# Altium schematic sheet Senkron_buck.SchDoc (part 1 of 3)
size A3; SheetNumber: 1; SheetTotal: 1
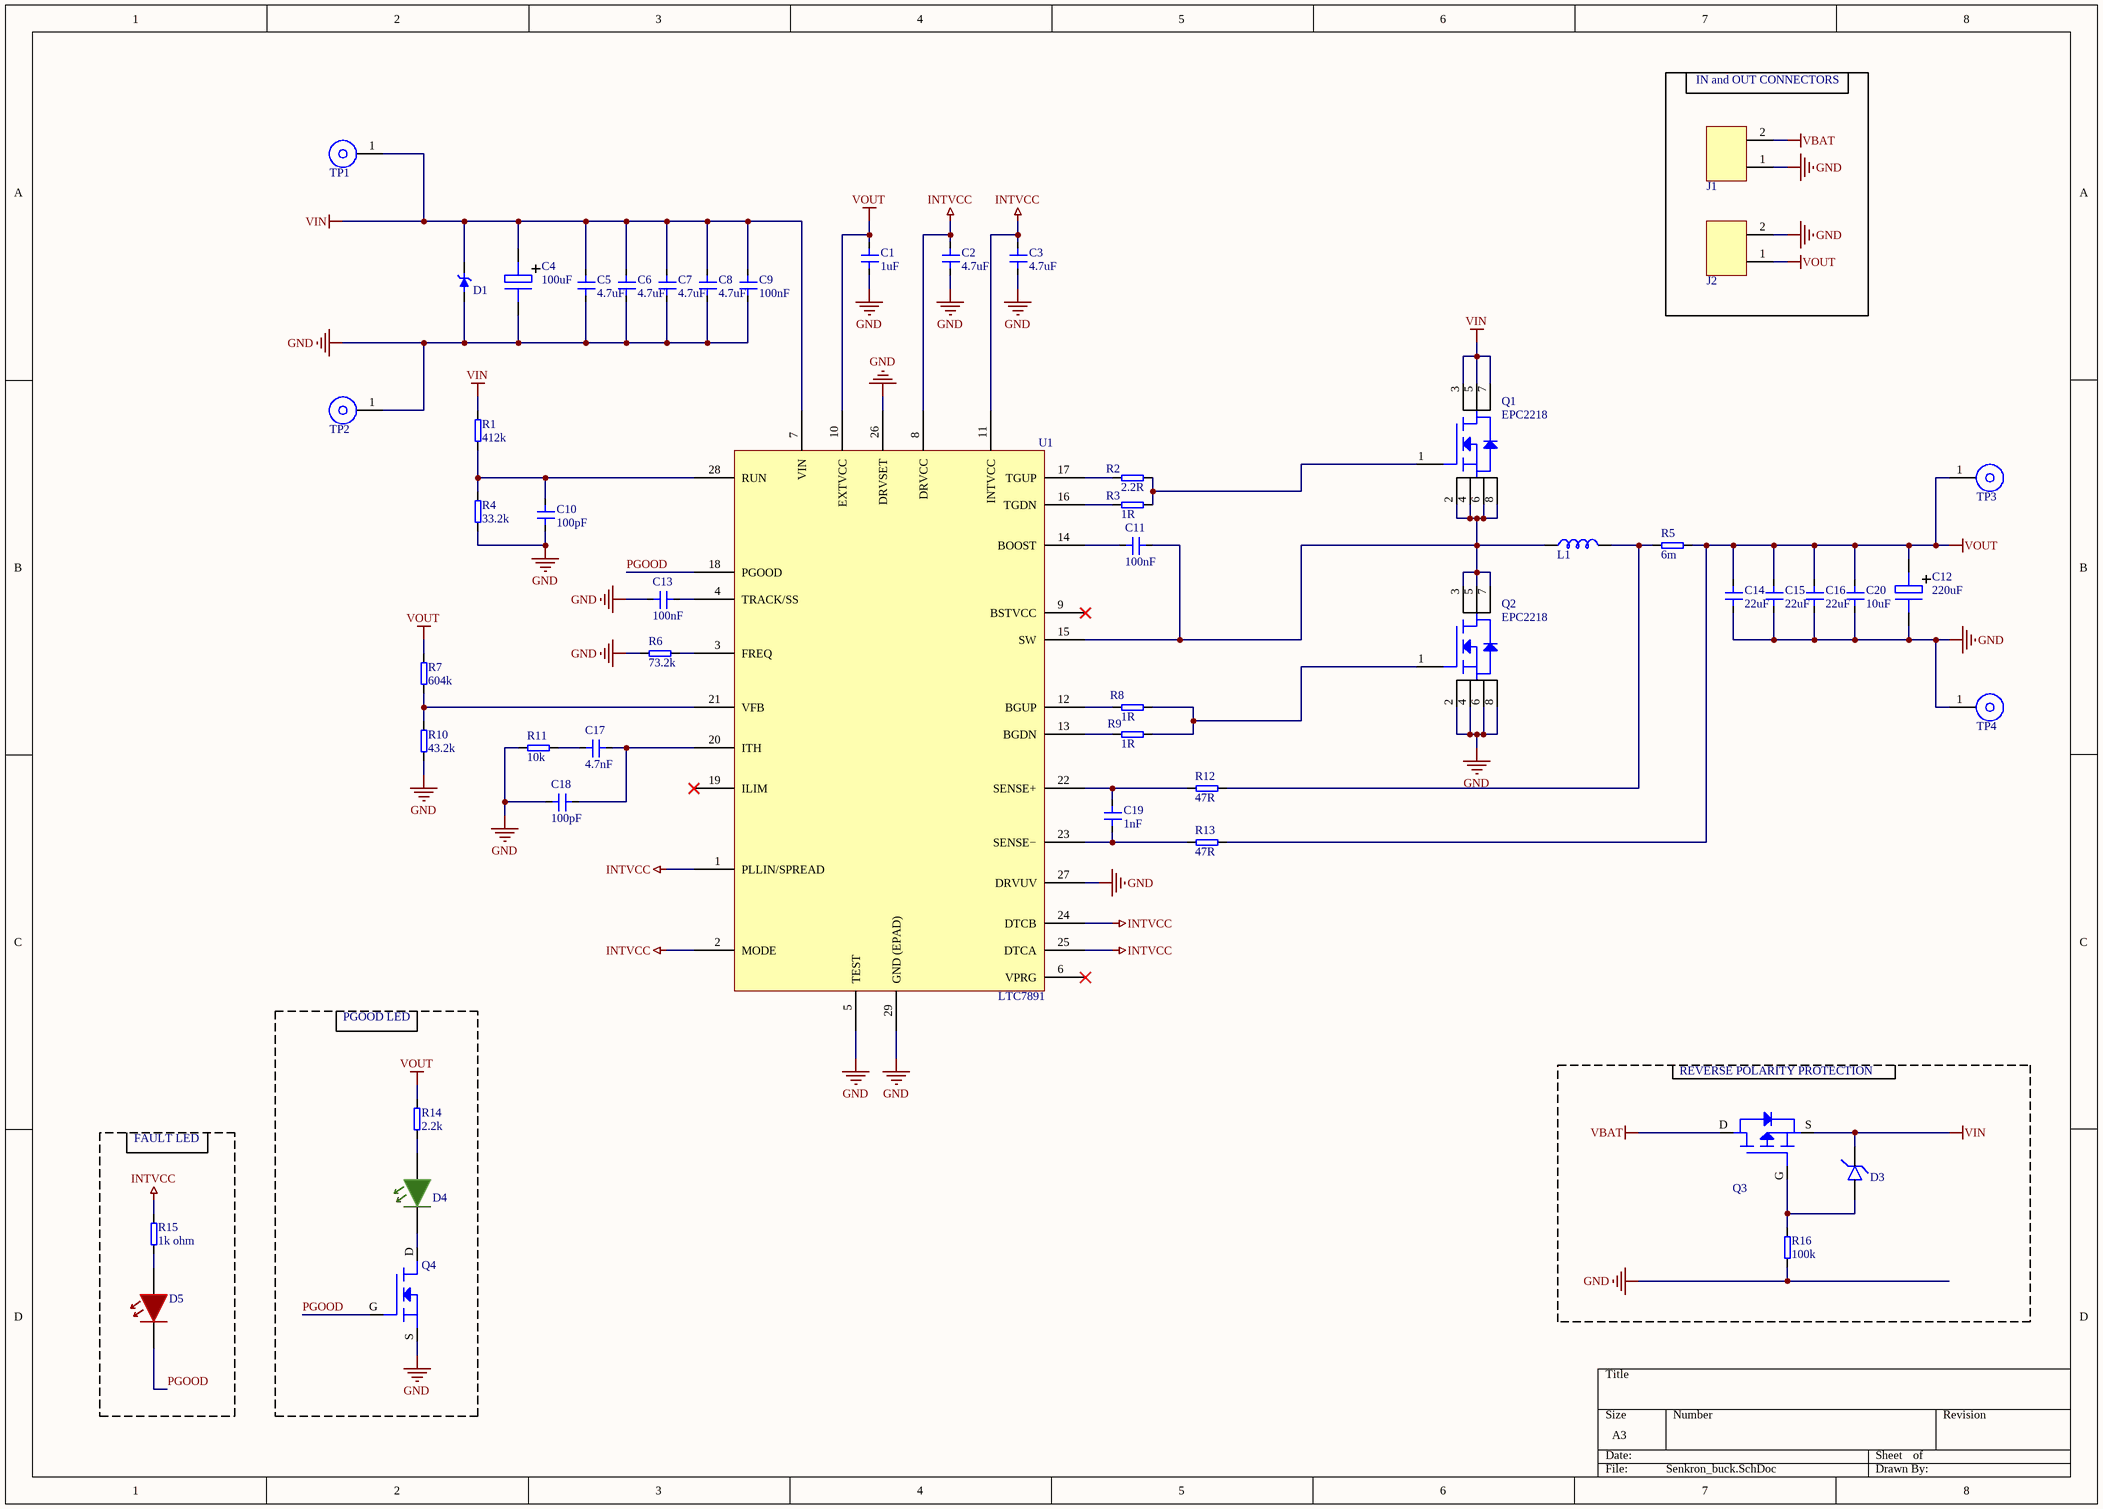
[diagram p0: Senkron_buck.SchDoc]

## Parts
C1  1uF  [0603 CAP SER]
C2  4.7uF  [0603 CAP SER]
C3  4.7uF  [0603 CAP SER]
C4  100uF  [CAP ELEC 12.5X10]
C5  4.7uF  [1210 CAP SER]
C6  4.7uF  [1210 CAP SER]
C7  4.7uF  [1210 CAP SER]
C8  4.7uF  [1210 CAP SER]
C9  100nF  [0603 CAP SER]
C10  100pF  [0603 CAP SER]
C11  100nF  [0603 CAP SER]
C12  220uF  [CAP ELEC 10x10]
C13  100nF  [0603 CAP SER]
C14  22uF  [1210 CAP SER]
C15  22uF  [1210 CAP SER]
C16  22uF  [1210 CAP SER]
C17  4.7nF  [0603 CAP SER]
C18  100pF  [0603 CAP SER]
C19  1nF  [0603 CAP SER]
C20  10uF  [1206 CAP SER]
D1  SMAJ40A-HT  [DO-214AC SMA]  (value not drawn)
D3  MMSZ15V-HT  [SOD-123]  (value not drawn)
D4  LED SMD 0805 GREEN 18-45mcd 140° WATER CLEAR  [LED 0805 GREEN]  (value not drawn)
D5  LED SMD 0805 RED 45~112mcd 120C  [LED 0805 RED]  (value not drawn)
J1  2P Screw Terminal Block 2 pin  [2P Screw Terminal Block 2 pin]  (value not drawn)
J2  2P Screw Terminal Block 2 pin  [2P Screw Terminal Block 2 pin]  (value not drawn)
L1  10 µH Shielded Drum Core, Wirewound Inductor 21 A 3.4mOhm Nonstandard  [74435581000 INDUCTOR]  (value not drawn)
Q1  EPC2218  [EPC2218]
Q2  EPC2218  [EPC2218]
Q3  MOSFET DIS.52A 60V P-CH POWERPAKSO-8  [PowerPAK® SO-8L SINGLE]  (value not drawn)
Q4  PJA3416AE_R1_00001  [SOT-23 MOSFET]  (value not drawn)
R1  412k  [0805 RES]
R2  2.2R  [0603 RES]
R3  1R  [0603 RES]
R4  33.2k  [0805 RES]
R5  6m  [1206 RES]
R6  73.2k  [0603 RES]
R7  604k  [0805 RES]
R8  1R  [0603 RES]
R9  1R  [0603 RES]
R10  43.2k  [0805 RES]
R11  10k  [0603 RES]
R12  47R  [0603 RES]
R13  47R  [0603 RES]
R14  2.2k  [0603 RES]
R15  1k ohm  [0603 RES]
R16  100k  [0603 RES]
TP1  Test Point  [Test Point THT]  (value not drawn)
TP2  Test Point  [Test Point THT]  (value not drawn)
TP3  Test Point  [Test Point THT]  (value not drawn)
TP4  Test Point  [Test Point THT]  (value not drawn)
U1  LTC7891  [28-Lead Plastic Side Wettable QFN (4mm × 5mm)]

## Blocks framed on the sheet
IN and OUT CONNECTORS: J1 J2
PGOOD LED: D4 Q4 R14
REVERSE POLARİTY PROTECTİON: D3 Q3 R16
FAULT LED: D5 R15

## Nets
GND: C1.1 C2.1 C3.1 C4.2 C5.1 C6.1 C7.1 C8.1 C9.1 C10.1 C12.2 C13.1 C14.1 C15.1 C16.1 C18.1 C20.1 D1.A J1.1 J2.2 Q2.2 Q2.4 Q2.6 Q2.8 Q4.S R4.1 R6.1 R10.1 R11.1 R16.1 TP2.1 TP4.1 U1.5(TEST) U1.26(DRVSET) U1.27(DRVUV) U1.29(GND_(EPAD))
INTVCC: C2.2 C3.2 R15.2 U1.1(PLLIN/SPREAD) U1.2(MODE) U1.8(DRVCC) U1.11(INTVCC) U1.24(DTCB) U1.25(DTCA)
VBAT: J1.2 Q3.D
VIN: C4.1 C5.2 C6.2 C7.2 C8.2 C9.2 D1.K D3.K(Katot) Q1.3 Q1.5 Q1.7 Q3.S R1.2 TP1.1 U1.7(VIN)
VOUT: C1.2 C12.1 C14.2 C15.2 C16.2 C20.2 J2.1 R5.2 R7.2 R13.2 R14.2 TP3.1 U1.10(EXTVCC)
PGOOD: D5.2 Q4.G U1.18(PGOOD)
NetC10_2: C10.2 R1.1 R4.2 U1.28(RUN)
NetC11_1: C11.1 U1.14(BOOST)
NetC11_2: C11.2 L1.1 Q1.2 Q1.4 Q1.6 Q1.8 Q2.3 Q2.5 Q2.7 U1.15(SW)
NetC13_2: C13.2 U1.4(TRACK/SS)
NetC17_1: C17.1 R11.2
NetC17_2: C17.2 C18.2 U1.20(ITH)
NetC19_1: C19.1 R13.1 U1.23(SENSE−)
NetC19_2: C19.2 R12.1 U1.22(SENSE+)
NetD3_A: D3.A(Anot) Q3.G R16.2
NetD4_1: D4.1 R14.1
NetD4_2: D4.2 Q4.D
NetD5_1: D5.1 R15.1
NetL1_2: L1.2 R5.1 R12.2
NetQ1_1: Q1.1 R2.2 R3.2
NetQ2_1: Q2.1 R8.2 R9.2
NetR2_1: R2.1 U1.17(TGUP)
NetR3_1: R3.1 U1.16(TGDN)
NetR6_2: R6.2 U1.3(FREQ)
NetR7_1: R7.1 R10.2 U1.21(VFB)
NetR8_1: R8.1 U1.12(BGUP)
NetR9_1: R9.1 U1.13(BGDN)

Not connected (* = marked no-connect by the designer): U1 6(VPRG)* 9(BSTVCC)* 19(ILIM)*